# EAGLE schematic Electronic Circuit - Eagle (EAGLE 9.6.2)
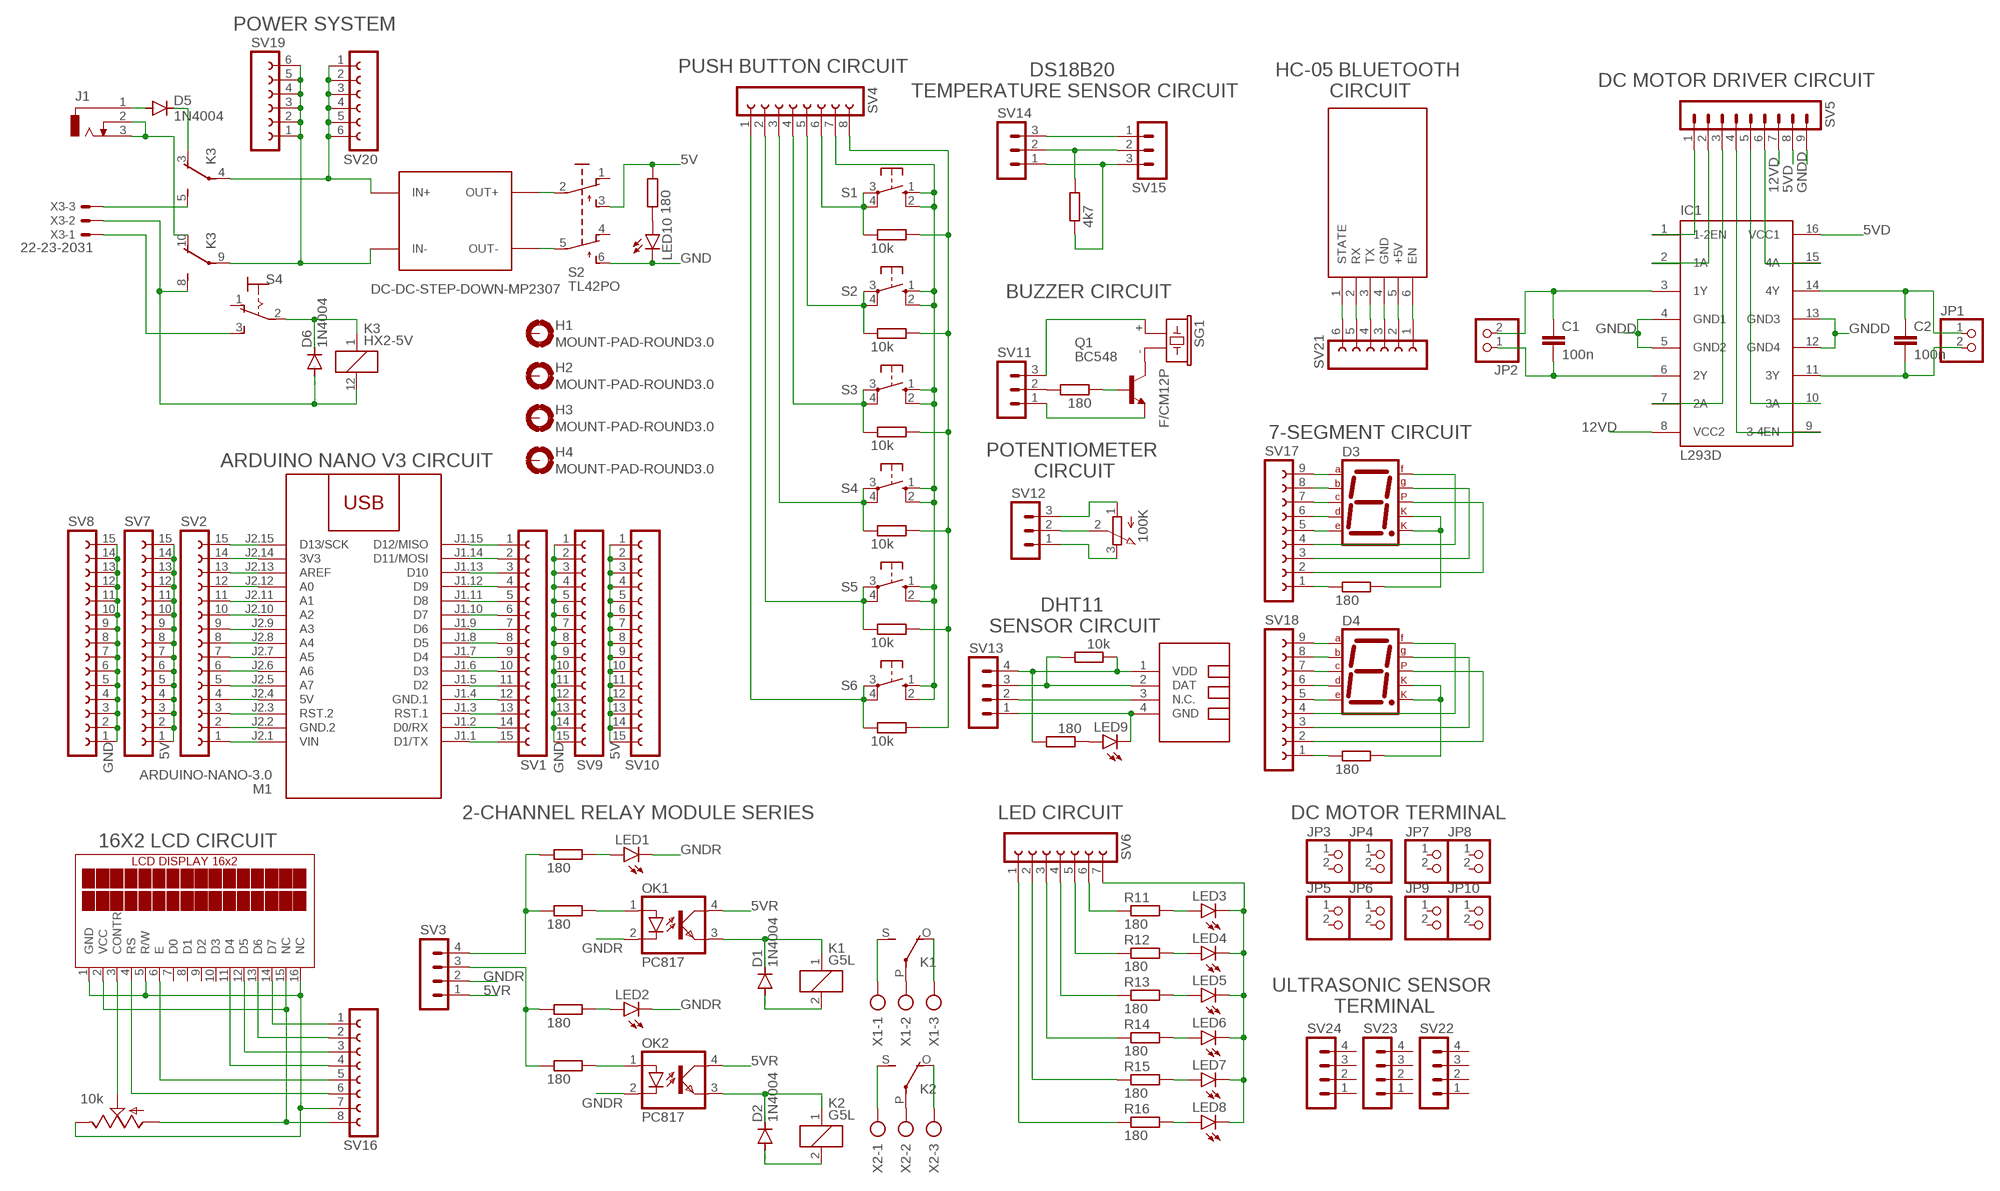
[diagram p0: schematic, sheet 1]

## Parts
C1  100n  C-EU050-024X044  [C050-024X044]
C2  100n  C-EU050-024X044  [C050-024X044]
D1  1N4004  [DO41-10]
D2  1N4004  [DO41-10]
D3  7SEG-CK  [7SEG-13]
D4  7SEG-CK  [7SEG-13]
D5  1N4004  [DO41-10]
D6  1N4004  [DO41-10]
DIS1  TUXGR_16X2_R2  [TUXGR_16X2_R2]
H1  MOUNT-PAD-ROUND3.0  [3,0-PAD]
H2  MOUNT-PAD-ROUND3.0  [3,0-PAD]
H3  MOUNT-PAD-ROUND3.0  [3,0-PAD]
H4  MOUNT-PAD-ROUND3.0  [3,0-PAD]
IC1  L293D  [DIL16]
J1  DCJ0303  [DCJ0303]
JP1  PINHD-1X2  [1X02]
JP2  PINHD-1X2  [1X02]
JP3  PINHD-1X2  [1X02]
JP4  PINHD-1X2  [1X02]
JP5  PINHD-1X2  [1X02]
JP6  PINHD-1X2  [1X02]
JP7  PINHD-1X2  [1X02]
JP8  PINHD-1X2  [1X02]
JP9  PINHD-1X2  [1X02]
JP10  PINHD-1X2  [1X02]
K1  G5L  [G5LE]
K2  G5L  [G5LE]
K3  HX2-5V  [HX]
LED1  LED3MM  [LED3MM]
LED2  LED3MM  [LED3MM]
LED3  LED3MM  [LED3MM]
LED4  LED3MM  [LED3MM]
LED5  LED3MM  [LED3MM]
LED6  LED3MM  [LED3MM]
LED7  LED3MM  [LED3MM]
LED8  LED3MM  [LED3MM]
LED9  LED3MM  [LED3MM]
LED10  LED3MM  [LED3MM]
M1  ARDUINO-NANO-3.0  [ARDUINO-NANO-3.0]
OK1  PC817  [DIL04]
OK2  PC817  [DIL04]
Q1  BC548  [TO92-EBC]
R1  180  R-EU_0204/7  [0204/7]
R2  180  R-EU_0204/7  [0204/7]
R3  180  R-EU_0204/7  [0204/7]
R4  180  R-EU_0204/7  [0204/7]
R5  10k  R-EU_0204/7  [0204/7]
R6  10k  R-EU_0204/7  [0204/7]
R7  10k  R-EU_0204/7  [0204/7]
R8  10k  R-EU_0204/7  [0204/7]
R9  10k  R-EU_0204/7  [0204/7]
R10  10k  R-EU_0204/7  [0204/7]
R11  180  R-EU_0204/7  [0204/7]
R12  180  R-EU_0204/7  [0204/7]
R13  180  R-EU_0204/7  [0204/7]
R14  180  R-EU_0204/7  [0204/7]
R15  180  R-EU_0204/7  [0204/7]
R16  180  R-EU_0204/7  [0204/7]
R17  180  R-EU_0204/7  [0204/7]
R18  100K  EVUF2A  [EVUF]
R19  10k  R-EU_0204/7  [0204/7]
R20  180  R-EU_0204/7  [0204/7]
R21  4k7  R-EU_0204/7  [0204/7]
R22  10k  TRIM_US-CA6V  [CA6V]
R23  180  R-EU_0204/7  [0204/7]
R24  180  R-EU_0204/7  [0204/7]
R25  180  R-EU_0204/7  [0204/7]
S1  10-XX  [B3F-10XX]
S2  TL42PO  [TL4XPO]
S3  10-XX  [B3F-10XX]
S4  M9040P  [M9040P]
S5  10-XX  [B3F-10XX]
S6  10-XX  [B3F-10XX]
S7  10-XX  [B3F-10XX]
S8  10-XX  [B3F-10XX]
SG1  F/CM12P  [F/CM12P]
SV1  FE15-1  [FE15]
SV2  FE15-1  [FE15]
SV3  MA04-1  [MA04-1]
SV4  FE08-1  [FE08]
SV5  MA09-1  [MA09-1]
SV6  FE07-1  [FE07]
SV7  FE15-1  [FE15]
SV8  FE15-1  [FE15]
SV9  FE15-1  [FE15]
SV10  FE15-1  [FE15]
SV11  MA03-1  [MA03-1]
SV12  MA03-1  [MA03-1]
SV13  MA04-1  [MA04-1]
SV14  MA03-1  [MA03-1]
SV15  MA03-1  [MA03-1]
SV16  FE08-1  [FE08]
SV17  FE09-1  [FE09]
SV18  FE09-1  [FE09]
SV19  FE06-1  [FE06]
SV20  FE06-1  [FE06]
SV21  FE06-1  [FE06]
SV22  MA04-1  [MA04-1]
SV23  MA04-1  [MA04-1]
SV24  MA04-1  [MA04-1]
U$1  TEMP-HUM-SENSOR-DHT11  [TEMP-HUM-SENSOR-DHT11]
U$2  WIRELESS-BLUETOOTH-HC-05  [WIRELESS-BLUETOOTH-HC-05]
U$3  DC-DC-STEP-DOWN-MP2307  [DC-DC-STEP-DOWN-MP2307]
X1  AK500/3  [AK500/3]
X2  AK500/3  [AK500/3]
X3  22-23-2031  [22-23-2031]

## Nets
5V: R25.2 S2.3(S) SV7.1 SV7.2 SV7.3 SV7.4 SV7.5 SV7.6 SV7.7 SV7.8 SV7.9 SV7.10 SV7.11 SV7.12 SV7.13 SV7.14 SV7.15 SV10.1 SV10.2 SV10.3 SV10.4 SV10.5 SV10.6 SV10.7 SV10.8 SV10.9 SV10.10 SV10.11 SV10.12 SV10.13 SV10.14 SV10.15
5VD: IC1.16(VCC1) SV5.8
5VR: OK1.4(COL) OK2.4(COL) SV3.1
12VD: IC1.8(VCC2) SV5.7
GND: LED10.K(C) S2.6(S1) SV8.1 SV8.2 SV8.3 SV8.4 SV8.5 SV8.6 SV8.7 SV8.8 SV8.9 SV8.10 SV8.11 SV8.12 SV8.13 SV8.14 SV8.15 SV9.1 SV9.2 SV9.3 SV9.4 SV9.5 SV9.6 SV9.7 SV9.8 SV9.9 SV9.10 SV9.11 SV9.12 SV9.13 SV9.14 SV9.15
GNDD: IC1.4(GND1) IC1.5(GND2) IC1.12(GND4) IC1.13(GND3) SV5.9
GNDR: LED1.K(C) LED2.K(C) OK1.2(C) OK2.2(C) SV3.2
N$1: M1.J2.15(D13/SCK) SV2.15
N$2: M1.J2.14(3V3) SV2.14
N$3: M1.J2.13(AREF) SV2.13
N$4: M1.J2.12(A0) SV2.12
N$5: M1.J2.11(A1) SV2.11
N$6: M1.J2.10(A2) SV2.10
N$7: M1.J2.9(A3) SV2.9
N$8: M1.J2.8(A4) SV2.8
N$9: M1.J2.7(A5) SV2.7
N$10: M1.J2.6(A6) SV2.6
N$11: M1.J2.5(A7) SV2.5
N$12: M1.J2.4(5V) SV2.4
N$13: M1.J2.3(RST.2) SV2.3
N$14: M1.J2.2(GND.2) SV2.2
N$15: M1.J2.1(VIN) SV2.1
N$16: M1.J1.1(D1/TX) SV1.15
N$17: M1.J1.2(D0/RX) SV1.14
N$18: M1.J1.3(RST.1) SV1.13
N$19: M1.J1.4(GND.1) SV1.12
N$20: M1.J1.5(D2) SV1.11
N$21: M1.J1.6(D3) SV1.10
N$22: M1.J1.7(D4) SV1.9
N$23: M1.J1.8(D5) SV1.8
N$24: M1.J1.9(D6) SV1.7
N$25: M1.J1.10(D7) SV1.6
N$26: M1.J1.11(D8) SV1.5
N$27: M1.J1.12(D9) SV1.4
N$28: M1.J1.13(D10) SV1.3
N$29: M1.J1.14(D11/MOSI) SV1.2
N$30: M1.J1.15(D12/MISO) SV1.1
N$31: OK1.1(A) R1.2
N$32: D1.C K1.1 OK1.3(EMIT)
N$33: D1.A K1.2
N$34: K1.S(2:S) X1.1
N$35: K1.P(2:P) X1.2
N$36: K1.O(2:O) X1.3
N$37: OK2.1(A) R2.2
N$38: D2.C K2.1 OK2.3(EMIT)
N$39: D2.A K2.2
N$40: K2.S(2:S) X2.1
N$41: K2.P(2:P) X2.2
N$42: K2.O(2:O) X2.3
N$43: R2.1 R4.1 SV3.3
N$44: R1.1 R3.1 SV3.4
N$45: LED1.A R3.2
N$46: LED2.A R4.2
N$47: C1.1 IC1.3(1Y) JP2.2
N$48: C1.2 IC1.6(2Y) JP2.1
N$49: C2.1 IC1.14(4Y) JP1.1
N$50: C2.2 IC1.11(3Y) JP1.2
N$51: IC1.1(1-2EN) SV5.1
N$52: IC1.2(1A) SV5.2
N$53: IC1.7(2A) SV5.3
N$54: IC1.9(3-4EN) SV5.4
N$55: IC1.10(3A) SV5.5
N$56: IC1.15(4A) SV5.6
N$57: R5.1 S1.3(P) S1.4(P1) SV4.6
N$58: R6.1 S3.3(P) S3.4(P1) SV4.5
N$59: R7.1 S5.3(P) S5.4(P1) SV4.4
N$60: R8.1 S6.3(P) S6.4(P1) SV4.3
N$61: R9.1 S7.3(P) S7.4(P1) SV4.2
N$62: R10.1 S8.3(P) S8.4(P1) SV4.1
N$63: S1.1(S) S1.2(S1) S3.1(S) S3.2(S1) S5.1(S) S5.2(S1) S6.1(S) S6.2(S1) S7.1(S) S7.2(S1) S8.1(S) S8.2(S1) SV4.7
N$64: R5.2 R6.2 R7.2 R8.2 R9.2 R10.2 SV4.8
N$65: LED3.A R11.2
N$66: LED4.A R12.2
N$67: LED5.A R13.2
N$68: LED6.A R14.2
N$69: LED7.A R15.2
N$70: LED8.A R16.2
N$71: LED3.K(C) LED4.K(C) LED5.K(C) LED6.K(C) LED7.K(C) LED8.K(C) SV6.7
N$72: R11.1 SV6.6
N$73: R12.1 SV6.5
N$74: R13.1 SV6.4
N$75: R14.1 SV6.3
N$76: R15.1 SV6.2
N$77: R16.1 SV6.1
N$80: SG1.+ SV11.3
N$83: Q1.E SV11.1
N$84: Q1.C SG1.-
N$85: Q1.B R17.2
N$86: R17.1 SV11.2
N$87: R18.2(S) SV12.2
N$88: R18.1(A) SV12.3
N$89: R18.3(E) SV12.1
N$90: R19.1 R20.2 SV13.4 U$1.1(VDD)
N$91: R19.2 SV13.3 U$1.2(DAT)
N$92: SV13.2 U$1.3(N.C.)
N$93: SV14.3 SV15.1
N$94: LED9.K(C) SV13.1 U$1.4(GND)
N$95: R21.2 SV14.2 SV15.2
N$96: LED9.A R20.1
N$97: R21.1 SV14.1 SV15.3
N$98: DIS1.1(GND) DIS1.5(R/W) DIS1.16(NC) R22.E SV16.7
N$99: DIS1.2(VCC) DIS1.15(NC) R22.A SV16.8
N$100: DIS1.3(CONTR) R22.S
N$101: DIS1.14(D7) SV16.1
N$102: DIS1.13(D6) SV16.2
N$103: DIS1.12(D5) SV16.3
N$104: DIS1.11(D4) SV16.4
N$105: DIS1.6(E) SV16.5
N$106: DIS1.4(RS) SV16.6
N$107: R23.1 SV17.1
N$108: D3.3(CK1) D3.8(CK2) R23.2
N$109: D3.7(A) SV17.9
N$110: D3.6(B) SV17.8
N$111: D3.4(C) SV17.7
N$112: D3.2(D) SV17.6
N$113: D3.1(E) SV17.5
N$114: D3.9(F) SV17.4
N$115: D3.10(G) SV17.3
N$116: D3.5(DP) SV17.2
N$117: R24.1 SV18.1
N$118: D4.3(CK1) D4.8(CK2) R24.2
N$119: D4.7(A) SV18.9
N$120: D4.6(B) SV18.8
N$121: D4.4(C) SV18.7
N$122: D4.2(D) SV18.6
N$123: D4.1(E) SV18.5
N$124: D4.9(F) SV18.4
N$125: D4.10(G) SV18.3
N$126: D4.5(DP) SV18.2
N$127: S2.2(P) U$3.OUT+
N$128: S2.5(P1) U$3.OUT-
N$131: LED10.A R25.1
N$132: SV21.1 U$2.6(EN)
N$133: SV21.2 U$2.5(+5V)
N$134: D6.C K3.1 S4.2(P)
N$135: D5.A J1.1
N$136: J1.2 J1.3 K3.10(3:O)
N$137: D5.C K3.3(2:O)
N$138: K3.5(2:S) X3.3
N$139: D6.A K3.8(3:S) K3.12 X3.2
N$140: S4.3(S) X3.1
N$146: K3.9(3:P) SV19.1 SV19.2 SV19.3 SV19.4 SV19.5 SV19.6 U$3.IN-
N$147: K3.4(2:P) SV20.1 SV20.2 SV20.3 SV20.4 SV20.5 SV20.6 U$3.IN+
N$148: SV21.3 U$2.4(GND)
N$149: SV21.4 U$2.3(TX)
N$150: SV21.5 U$2.2(RX)
N$151: SV21.6 U$2.1(STATE)
Unconnected: DIS1.7(D0) DIS1.8(D1) DIS1.9(D2) DIS1.10(D3) H1.B3,0(MOUNT) H2.B3,0(MOUNT) H3.B3,0(MOUNT) H4.B3,0(MOUNT) JP3.1 JP3.2 JP4.1 JP4.2 JP5.1 JP5.2 JP6.1 JP6.2 JP7.1 JP7.2 JP8.1 JP8.2 JP9.1 JP9.2 JP10.1 JP10.2 S2.1(O) S2.4(O1) S4.1(O) SV22.1 SV22.2 SV22.3 SV22.4 SV23.1 SV23.2 SV23.3 SV23.4 SV24.1 SV24.2 SV24.3 SV24.4

## Notes on the sheet
- POWER SYSTEM
- PUSH BUTTON CIRCUIT
- DS18B20 
  TEMPERATURE SENSOR CIRCUIT
- HC-05 BLUETOOTH 
  CIRCUIT
- DC MOTOR DRIVER CIRCUIT
- S1
- S2 | BUZZER CIRCUIT
- S3
- 7-SEGMENT CIRCUIT
- ARDUINO NANO V3 CIRCUIT
- POTENTIOMETER 
  CIRCUIT
- S4
- S5
- DHT11 
  SENSOR CIRCUIT
- S6
- 2-CHANNEL RELAY MODULE SERIES | LED CIRCUIT | DC MOTOR TERMINAL
- 16X2 LCD CIRCUIT
- ULTRASONIC SENSOR 
  TERMINAL

## Library data of the parts
C1 C2 = rcl:C-EU: CAPACITOR, European symbol; SPICEPREFIX: C
D1 D2 D5 D6 = diode:1N4004: DIODE general purpose rectifier, 1 A
D3 D4 = special:7SEG-CK: 7-segment DISPLAY single cathode, 13 mm
DIS1 = display-lcd:TUXGR_16X2_R2: Tuxgraphics LCD display 16x2 characters reflective, without background light Source: tuxgr_12x2_r2.pdf; OC_FARNELL: unknown; OC_NEWARK: unknown
H1-H4 = holes:MOUNT-PAD-ROUND: MOUNTING PAD, round
IC1 = st-microelectronics:L293D: PUSH-PULL 4 CHANNEL DRIVER; MPN: L293D; OC_FARNELL: 9589619; OC_NEWARK: 56P8249
J1 = con-jack:DCJ0303: DC POWER JACK Source: DCJ0303.pdf; OC_FARNELL: unknown; OC_NEWARK: unknown
JP1-JP10 = pinhead:PINHD-1X2: PIN HEADER
K1 K2 = relay:G5L: RELAY 1 x switch, 10 A/120 V AC, 8 A/30 V ADC, Omron; OC_FARNELL: unknown; OC_NEWARK: unknown
K3 = relay:HX2-*: Compact & Slim 2 Form C Non-polarized Relay NAiS Source: http://www.mew-europe.com/.. en_ds_61011_0000.pdf; OC_FARNELL: unknown; OC_NEWARK: unknown
LED1-LED10 = led:LED: LED OSRAM: - CHIPLED LG R971, LG N971, LY N971, LG Q971, LY Q971, LO R971, LY R971 LH N974, LH R974 LS Q976, LO Q976, LY Q976 LO Q996 - Hyper CHIPLED LW Q18S LB Q993, LB Q99A, LB R99A - SideLED LS A670, LO A670, LY A670, LG A670, LP A670 LB A673, LV A673, LT A673, LW A673 LH A674 LY A675 LS A676, LA A676, LO A676, LY A676, LW A676 LS A679, LY A679, LG A679 - Hyper Micro SIDELED® LS Y876, LA Y876, LO Y876, LY Y876 LT Y87S - SmartLED LW L88C, LW L88S LB L89C, LB L89S, LG L890 LS L89K, LO L89K, LY L89K LS L896, LA L896, LO L896, LY L896 - TOPLED LS T670, LO T670, LY T670, LG T670, LP T670 LSG T670, LSP T670, LSY T670, LOP T670, LYG T670 LG T671, LOG T671, LSG T671 LB T673, LV T673, LT T673, LW T673 LH T674 LS T676, LA T676, LO T676, LY T676, LB T676, LH T676, LSB T676, LW T676 LB T67C, LV T67C, LT T67C, LS T67K, LO T67K, LY T67K, LW E67C LS E67B, LA E67B, LO E67B, LY E67B, LB E67C, LV E67C, LT E67C LW T67C LS T679, LY T679, LG T679 LS T770, LO T770, LY T770, LG T770, LP T770 LB T773, LV T773, LT T773, LW T773 LH T774 LS E675, LA E675, LY E675, LS T675 LS T776, LA T776, LO T776, LY T776, LB T776 LHGB T686 LT T68C, LB T68C - Hyper Mini TOPLED® LB M676 - Mini TOPLED Santana® LG M470 LS M47K, LO M47K, LY M47K Source: http://www.osram.convergy.de LUXEON: - LUMILED® LXK2-PW12-R00, LXK2-PW12-S00, LXK2-PW14-U00, LXK2-PW14-V00 LXK2-PM12-R00, LXK2-PM12-S00, LXK2-PM14-U00 LXK2-PE12-Q00, LXK2-PE12-R00, LXK2-PE12-S00, LXK2-PE14-T00, LXK2-PE14-U00 LXK2-PB12-K00, LXK2-PB12-L00, LXK2-PB12-M00, LXK2-PB14-N00, LXK2-PB14-P00, LXK2-PB14-Q00 LXK2-PR12-L00, LXK2-PR12-M00, LXK2-PR14-Q00, LXK2-PR14-R00 LXK2-PD12-Q00, LXK2-PD12-R00, LXK2-PD12-S00 LXK2-PH12-R00, LXK2-PH12-S00 LXK2-PL12-P00, LXK2-PL12-Q00, LXK2-PL12-R00 Source: www.luxeon.com KINGBRIGHT: KA-3528ASYC Source: www.kingbright.com
M1 = Arduino dan Step Down:ARDUINO-NANO-3.0: Arduino Nano 3.0 and compatible devices More details available here: https://www.arduino.cc/en/Main/ArduinoBoardNano Click here to find device on ebay.com <http://www.ebay.com/sch/arduino+nano>
OK1 OK2 = optocoupler:PC817: SHARP OPTO COUPLER; MPN: PC817X4J000F; OC_FARNELL: 9707727; OC_NEWARK: 97K7059
Q1 = transistor-npn:BC548*: NPN Transistor
R1-R17 R19-R21 R23-R25 = rcl:R-EU_: RESISTOR, European symbol; SPICEPREFIX: R
R18 = pot:EVU: 9 mm Square Rotary Potentiometers Source: Panasonic
R22 = pot:TRIM_US-: POTENTIOMETER
S1 S3 S5-S8 = switch-omron:10-XX: OMRON SWITCH; MPN: B3F-1000; OC_FARNELL: 176432; OC_NEWARK: 36M3542
S2 = switch:TL42PO: TINY SWITCH ON - MOM Source: http://www2.produktinfo.conrad.com/datenblaetter/700000-724999/705152-da-01-de-Subminiaturschalter_TL_36YO.pdf
S4 = switch:M9040P: TOGGLE SWITCH Marquardt
SG1 = buzzer:F/CM12P: BUZZER Source: Buerklin; OC_FARNELL: unknown; OC_NEWARK: unknown
SV1 SV2 SV7-SV10 = con-lsta:FE15-1: FEMALE HEADER; OC_FARNELL: unknown; OC_NEWARK: unknown
SV3 SV13 SV22-SV24 = con-lstb:MA04-1: PIN HEADER; OC_FARNELL: unknown; OC_NEWARK: unknown
SV4 SV16 = con-lsta:FE08-1: FEMALE HEADER; OC_FARNELL: unknown; OC_NEWARK: unknown
SV5 = con-lstb:MA09-1: PIN HEADER; OC_FARNELL: unknown; OC_NEWARK: unknown
SV6 = con-lsta:FE07-1: FEMALE HEADER; OC_FARNELL: unknown; OC_NEWARK: unknown
SV11 SV12 SV14 SV15 = con-lstb:MA03-1: PIN HEADER; OC_FARNELL: unknown; OC_NEWARK: unknown
SV17 SV18 = con-lsta:FE09-1: FEMALE HEADER; OC_FARNELL: unknown; OC_NEWARK: unknown
SV19-SV21 = con-lsta:FE06-1: FEMALE HEADER; OC_FARNELL: unknown; OC_NEWARK: unknown
U$1 = Arduino dan Step Down:TEMP-HUM-SENSOR-DHT11: DHT11 - digital humidity & temperature sensor DHT11 datasheet available here: https://akizukidenshi.com/download/ds/aosong/DHT11.pdf Click here to find device on ebay.com <http://www.ebay.com/sch/dht11+digital+sensor>
U$2 = Arduino dan Step Down:WIRELESS-BLUETOOTH-HC-05: Bluetooth Transceiver Module based on HC-05 board Tutorial is available here: https://arduino-info.wikispaces.com/BlueTooth-HC05-HC06-Modules-How-To Click here to find device on ebay.com <http://www.ebay.com/sch/hc-05+module+rs232>
U$3 = Arduino dan Step Down:DC-DC-STEP-DOWN-MP2307: DC/DC Step-Down Regulator based on MP2307DN chip MP2307 datasheet available here: https://cdn-shop.adafruit.com/datasheets/MP2307_r1.9.pdf Click here to find device on ebay.com <http://www.ebay.com/sch/dc+dc+3a+mini+converter>
X1 X2 = con-ptr500:AK500/3: CONNECTOR; OC_FARNELL: unknown; OC_NEWARK: unknown
X3 = con-molex:22-23-2031: .100" (2.54mm) Center Header - 3 Pin; MF: MOLEX; MPN: 22-23-2031; OC_FARNELL: 1462950; OC_NEWARK: 30C0862